# Altium schematic sheet 08 Peripherral.SchDoc
size A3
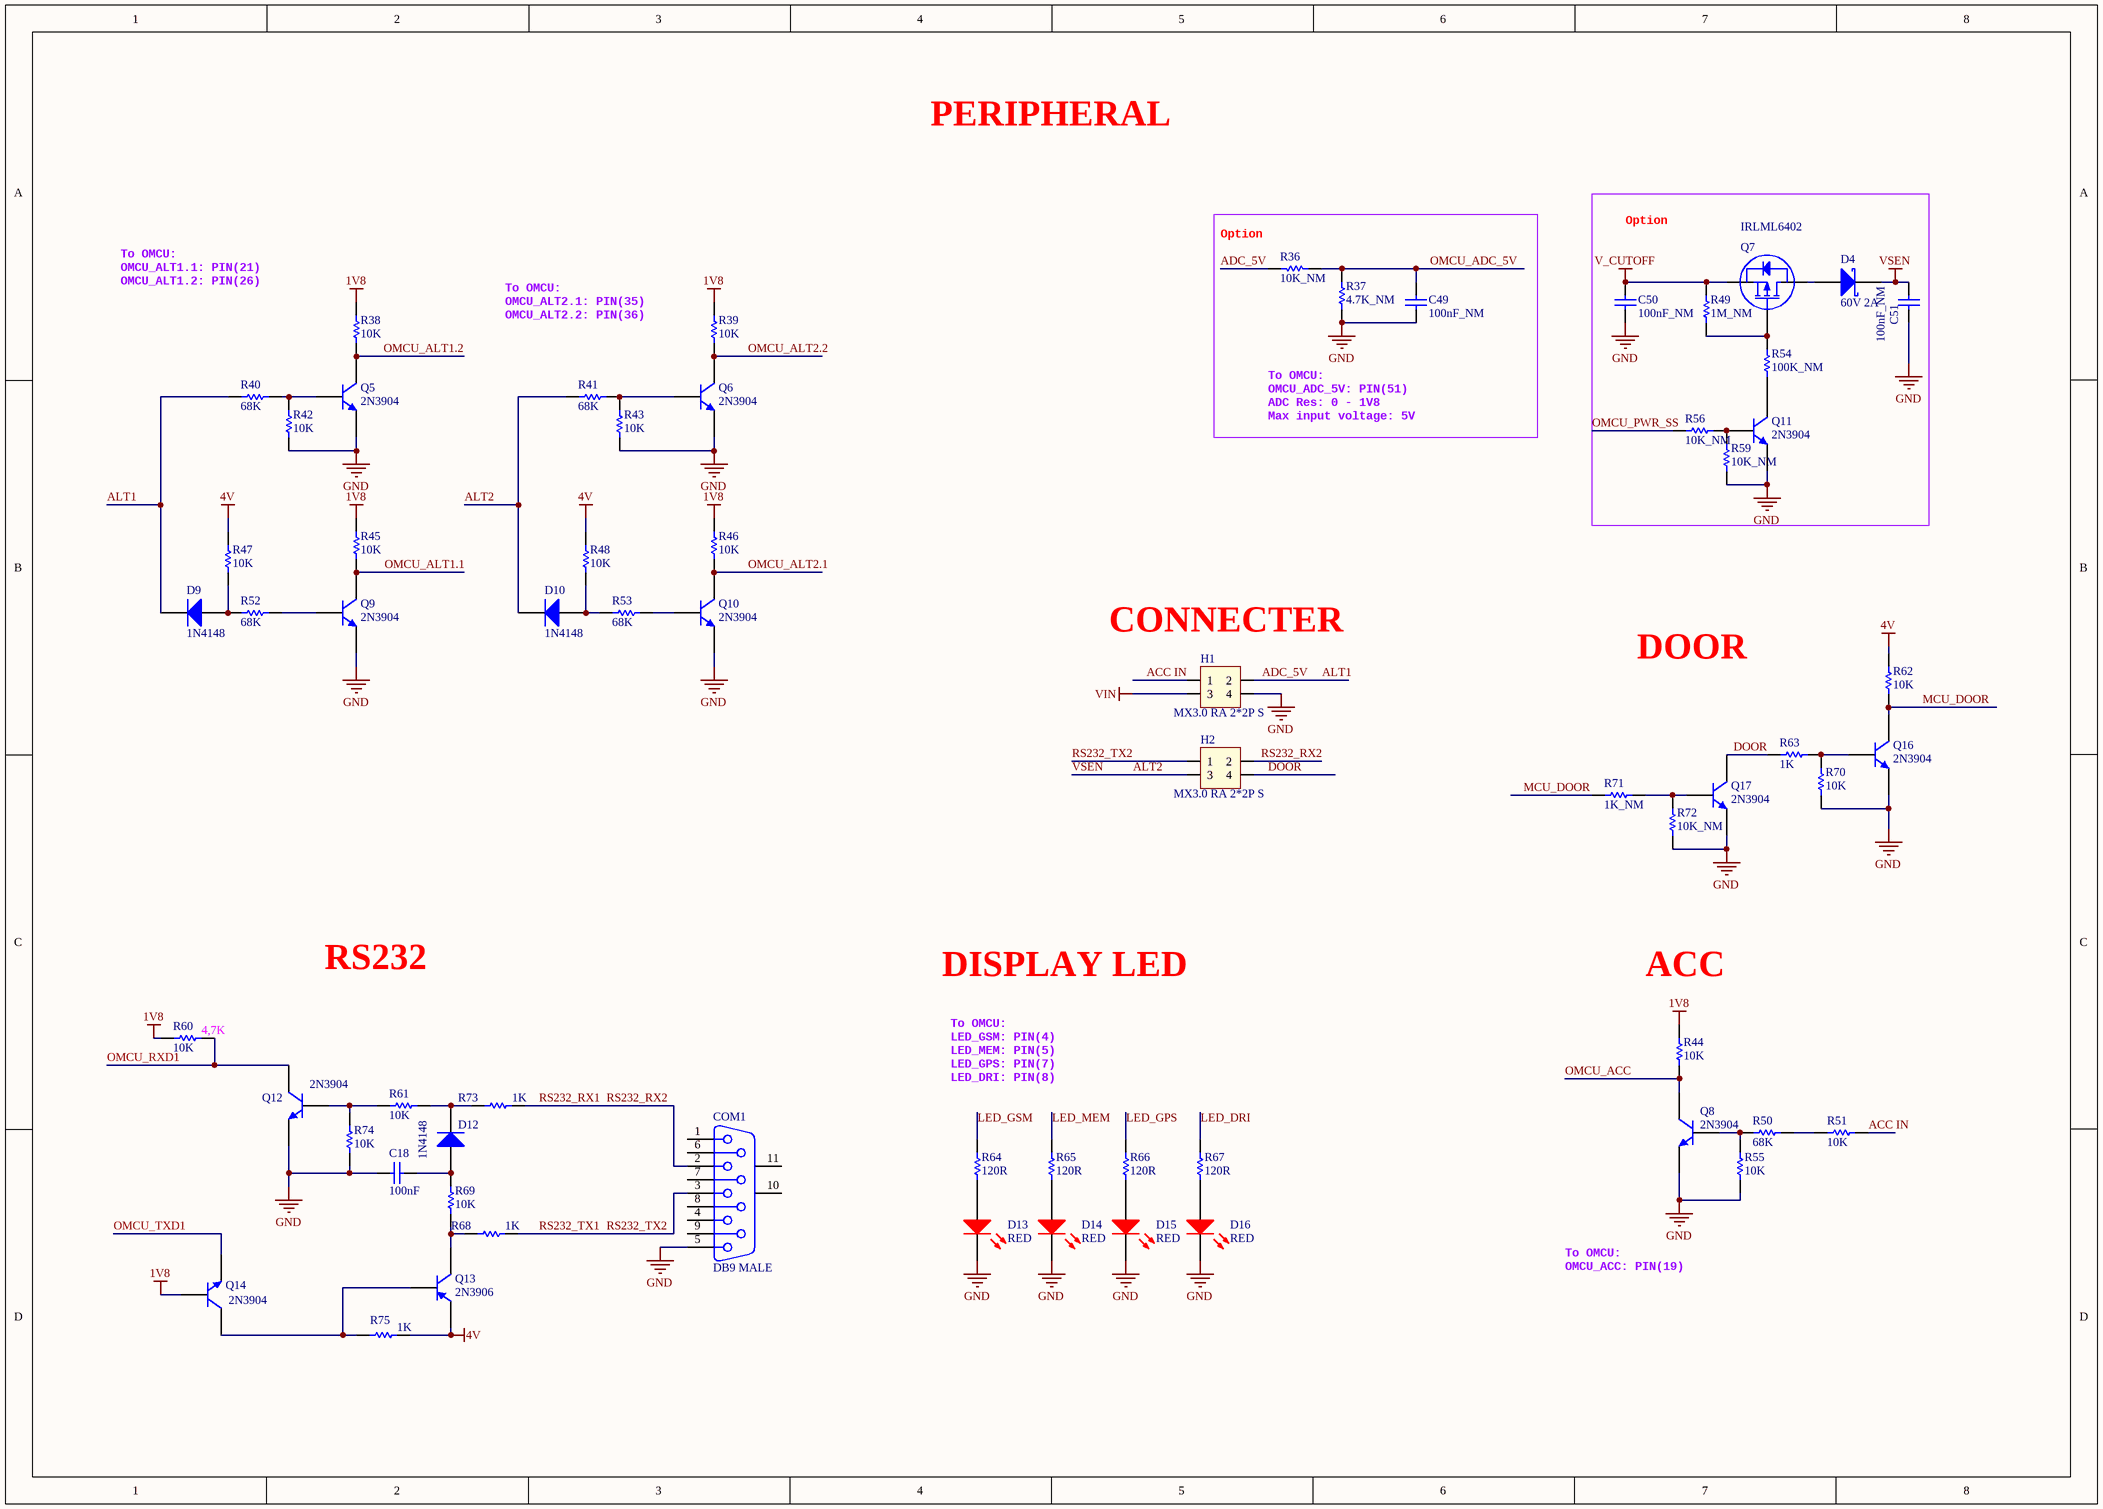
[diagram p0: 08 Peripherral.SchDoc]

## Parts
C18  100nF  [0603 - C]
C49  100nF_NM  [0603 - C]
C50  100nF_NM  [0603 - C]
C51  100nF_NM  [0603 - C]
COM1  DB9 MALE  [DSB 9M-SM]
D4  60V 2A  [SOD-123]
D9  1N4148  [SOD-123]
D10  1N4148  [SOD-123]
D12  1N4148  [SOD-123]
D13  RED  [LED - 0603 - R]
D14  RED  [LED - 0603 - R]
D15  RED  [LED - 0603 - R]
D16  RED  [LED - 0603 - R]
H1  MX3.0 RA 2*2P S  [43045-M3045-2x2-B]
H2  MX3.0 RA 2*2P S  [43045-M3045-2x2-B]
Q5  2N3904  [SOT23B]
Q6  2N3904  [SOT23B]
Q7  IRLML6402  [SOT23B]
Q8  2N3904  [SOT23B]
Q9  2N3904  [SOT23B]
Q10  2N3904  [SOT23B]
Q11  2N3904  [SOT23B]
Q12  2N3904  [SOT23B]
Q13  2N3906  [SOT23B]
Q14  2N3904  [SOT23B]
Q16  2N3904  [SOT23B]
Q17  2N3904  [SOT23B]
R36  10K_NM  [0603 - R]
R37  4.7K_NM  [0603 - R]
R38  10K  [0603 - R]
R39  10K  [0603 - R]
R40  68K  [0603 - R]
R41  68K  [0603 - R]
R42  10K  [0603 - R]
R43  10K  [0603 - R]
R44  10K  [0603 - R]
R45  10K  [0603 - R]
R46  10K  [0603 - R]
R47  10K  [0603 - R]
R48  10K  [0603 - R]
R49  1M_NM  [0603 - R]
R50  68K  [0603 - R]
R51  10K  [0603 - R]
R52  68K  [0603 - R]
R53  68K  [0603 - R]
R54  value 100K_NM  [0603 - R]  (hidden comment: 100K)
R55  10K  [0603 - R]
R56  value 10K_NM  [0603 - R]  (hidden comment: 10K)
R59  10K_NM  [0603 - R]
R60  10K  [0603 - R]
R61  10K  [0603 - R]
R62  10K  [0603 - R]
R63  1K  [0603 - R]
R64  120R  [0603 - R]
R65  120R  [0603 - R]
R66  120R  [0603 - R]
R67  120R  [0603 - R]
R68  1K  [0603 - R]
R69  10K  [0603 - R]
R70  10K  [0603 - R]
R71  1K_NM  [0603 - R]
R72  10K_NM  [0603 - R]
R73  1K  [0603 - R]
R74  10K  [0603 - R]
R75  1K  [0603 - R]

## Blocks framed on the sheet
Option: C50 C51 D4 Q7 Q11 R49 R54 R56 R59

## Nets
1V8: Q14.1(B) R38.2 R39.2 R44.2 R45.2 R46.2 R60.2
4V: Q13.2(E) R47.2 R48.2 R62.2 R75.2
ALT2: C51.2 D4.2(K) D10.2(K) H2.3 R41.1  [also labelled VSEN]
GND: C18.1 C49.1 C50.1 C51.1 COM1.5 D13.2(K) D14.2(K) D15.2(K) D16.2(K) H1.4 Q5.2(E) Q6.2(E) Q8.2(E) Q9.2(E) Q10.2(E) Q11.2(E) Q12.2(E) Q16.2(E) Q17.2(E) R37.1 R42.1 R43.1 R55.2 R59.1 R70.1 R72.1 R74.2
V_CUTOFF: C50.2 Q7.2(S) R49.2
VIN: H1.3
ACC IN: H1.1 R51.2
ADC_5V: D9.2(K) H1.2 R36.2 R40.1  [also labelled ALT1]
DOOR: H2.4 Q17.3(C) R63.1
LED_DRI: R67.2
LED_GPS: R66.2
LED_GSM: R64.2
LED_MEM: R65.2
MCU_DOOR: Q16.3(C) R62.1 R71.1
OMCU_ACC: Q8.3(C) R44.1
OMCU_ADC_5V: C49.2 R36.1 R37.2
OMCU_ALT1.1: Q9.3(C) R45.1
OMCU_ALT1.2: Q5.3(C) R38.1
OMCU_ALT2.1: Q10.3(C) R46.1
OMCU_ALT2.2: Q6.3(C) R39.1
OMCU_PWR_SS: R56.1
OMCU_RXD1: Q12.3(C) R60.1
OMCU_TXD1: Q14.2(E)
RS232_RX1: COM1.2 H2.2 R73.2  [also labelled RS232_RX2]
RS232_TX1: COM1.3 H2.1 R68.2  [also labelled RS232_TX2]
NetC18_2: C18.2 D12.1(A) R69.1
NetD4_1: D4.1(A) Q7.3(D)
NetD9_1: D9.1(A) R47.1 R52.1
NetD10_1: D10.1(A) R48.1 R53.1
NetD12_2: D12.2(K) R61.1 R73.1
NetD13_1: D13.1(A) R64.1
NetD14_1: D14.1(A) R65.1
NetD15_1: D15.1(A) R66.1
NetD16_1: D16.1(A) R67.1
NetQ5_1: Q5.1(B) R40.2 R42.2
NetQ6_1: Q6.1(B) R41.2 R43.2
NetQ7_1: Q7.1(G) R49.1 R54.2
NetQ8_1: Q8.1(B) R50.1 R55.1
NetQ9_1: Q9.1(B) R52.2
NetQ10_1: Q10.1(B) R53.2
NetQ11_1: Q11.1(B) R56.2 R59.2
NetQ11_3: Q11.3(C) R54.1
NetQ12_1: Q12.1(B) R61.2 R74.1
NetQ13_1: Q13.1(B) Q14.3(C) R75.1
NetQ13_3: Q13.3(C) R68.1 R69.2
NetQ16_1: Q16.1(B) R63.2 R70.2
NetQ17_1: Q17.1(B) R71.2 R72.2
NetR50_2: R50.2 R51.1

Not connected (* = marked no-connect by the designer): COM1 1 4 6 7 8 9 10(MH1) 11(MH2)

## Notes on the sheet
- PERIPHERAL
- (near R36) Option
- OMCU_ALT1.1: PIN(21)
- OMCU_ALT1.2: PIN(26)
- To OMCU:
- OMCU_ALT2.1: PIN(35)
- OMCU_ALT2.2: PIN(36)
- OMCU_ADC_5V: PIN(51)
- ADC Res: 0 - 1V8
- Max input voltage: 5V
- (near H1) CONNECTER
- DOOR
- RS232
- DISPLAY LED
- ACC
- (near R60) 4,7K
- LED_GSM: PIN(4)
- LED_MEM: PIN(5)
- LED_GPS: PIN(7)
- LED_DRI: PIN(8)
- OMCU_ACC: PIN(19)

## Library data of the parts
C18 C50 C51 = Cap 0603 100nF: CAP CER 100nF 50V C0G/NP0 0603; MPN: CL10C104JB8NNNC; MFR: SAMSUNG; Company ID: VT_CAP_C0603 100nF; Voltage: 50V; Package: 0603; Size: C0603: 100nF
  C18: Value: 100nF
  C50 C51: Value: 100nF_NM
C49 = Cap 0603 100nF: CAP CER 100nF 50V C0G/NP0 0603; MPN: CL10C104JB8NNNC; MFR: SAMSUNG; Company ID: VT_TỤ ĐIỆN_C0603 100nF; Voltage: 50V; Package: 0603; Value: 100nF_NM; Size: C0603: 100nF
COM1 = DB9M S: CONN D-SUB PLUG 9POS PNL MNT; MPN: 772-E09-103R001; MFR: Norcomp Inc.; Company ID: VT_CONN_DB9 male, thẳng
D4 = Diode PMEG6020ER: DIODE SCHOTTKY 60V 2A SOD123W; MPN: PMEG6020ER,115; MFR: NXP; Company ID: VT_DIODE_PMEG6020ER
D9 D10 D12 = Diode 1N4148: DIODE GEN PURP 100V 300MA SOD123; MPN: 1N4148W-7-F; MFR: DIODES; Company ID: VT_DIODE_1N4148W-7-F
D13-D16 = LED 0603 RED: LED RED CLEAR 0603 SMD; MFR: Everlight; MPN: QTLP601CRTR; Company ID: VT_LED_0603 RED; Size: LED 0603 - RED
H1 H2 = HD2x2 S: Micro-Fit 3.0™ Straight Header, 3.00mm Pitch, Dual Row, 4 Circuits; MPN: M3045-2x2-B; MFR: China; Company ID: VT_CONN_2*2 (M3045); MPN2: 43045-
Q5 Q6 Q8-Q12 Q14 Q16 Q17 = Transistor 2N3904: TRANS NPN 40V 0.2A SOT-23; MPN: MMBT3904; MFR: Fairchild; Company ID: VT_TRANSISTOR_3904
Q7 = IRLML6402TRPBF: MOSFET P-CH 30V 3.6A SOT-23-3; MFR: Infineon Technologies; Categories: TRANSISTOR; MPN: IRLML6402TRPBF
Q13 = Transistor 2N3906: TRANS PNP 40V 0.2A SOT23; MPN: MMBT3906; MFR: Fairchild; Company ID: VT_TRANSISTOR_3906
R36 R44 R59 R62 R72 = Res 0603 10K: RES SMD 10K OHM 1% 1/10W 0603; MFR: Yageo; MPN: RC0603FR-0710KL; Company ID: VT_ĐIỆN TRỞ_R0603 10K; Size: R0603: 10K
  R36 R59 R72: Value: 10K_NM
  R44 R62: Value: 10K
R37 = Res 0603 4.7K: RES SMD 4.7K OHM 1% 1/10W 0603; MFR: Yageo; MPN: RC0603FR-074K7L; Company ID: VT_RES_R0603 4.7K; Size: R0603: 4.7K; Value: 4.7K_NM
R38 R39 R42 R43 R45-R48 R51 R55 R56 R60 R61 R69 R70 R74 = Res 0603 10K: RES SMD 10K OHM 1% 1/10W 0603; MFR: Yageo; MPN: RC0603FR-0710KL; Company ID: VT_RES_R0603 10K; Size: R0603: 10K
  R38 R39 R42 R43 R45-R48 R51 R55 R60 R61 R69 R70 R74: Value: 10K
R40 R41 R50 R52 R53 = Res 0603 68K: RES SMD 68K OHM 1% 1/10W 0603; MFR: Yageo; MPN: RC0603FR-0768KL; Company ID: VT_ĐIỆN TRỞ_R0603 68K; Size: R0603: 68K; Value: 68K
R49 = Res 0603 1M: RES SMD 1M OHM 1% 1/10W 0603; MFR: Yageo; MPN: RC0603FR-071ML; Company ID: VT_RES_R0603 1M; Value: 1M_NM
R54 = Res 0603 100K: RES SMD 100K OHM 1% 1/10W 0603; MFR: Yageo; MPN: RC0603FR-07100KL; Company ID: VT_ĐIỆN TRỞ_R0603 100K; Size: R0603: 100K
R63 = Res 0603 1K: RES SMD 1K OHM 1% 1/10W 0603; MFR: Yageo; MPN: RC0603FR-071KL; Company ID: VT_RES_R0603 1K; Size: R0603: 1K; Value: 1K
R64-R67 = Res 0603 120R: RES SMD 120 OHM 1% 1/10W 0603; MFR: Yageo; MPN: AF0603FR-07120RL; Company ID: VT_RES_ R0603 120R; Size: R0603: 120R; Value: 120R
R68 R71 R73 R75 = Res 0603 1K: RES SMD 1K OHM 1% 1/10W 0603; MFR: Yageo; MPN: RC0603FR-071KL; Company ID: VT_ĐIỆN TRỞ_R0603 1K; Size: R0603: 1K
  R68 R73 R75: Value: 1K
  R71: Value: 1K_NM